# EAGLE schematic proportional configuration #1 (EAGLE 9.6.2)
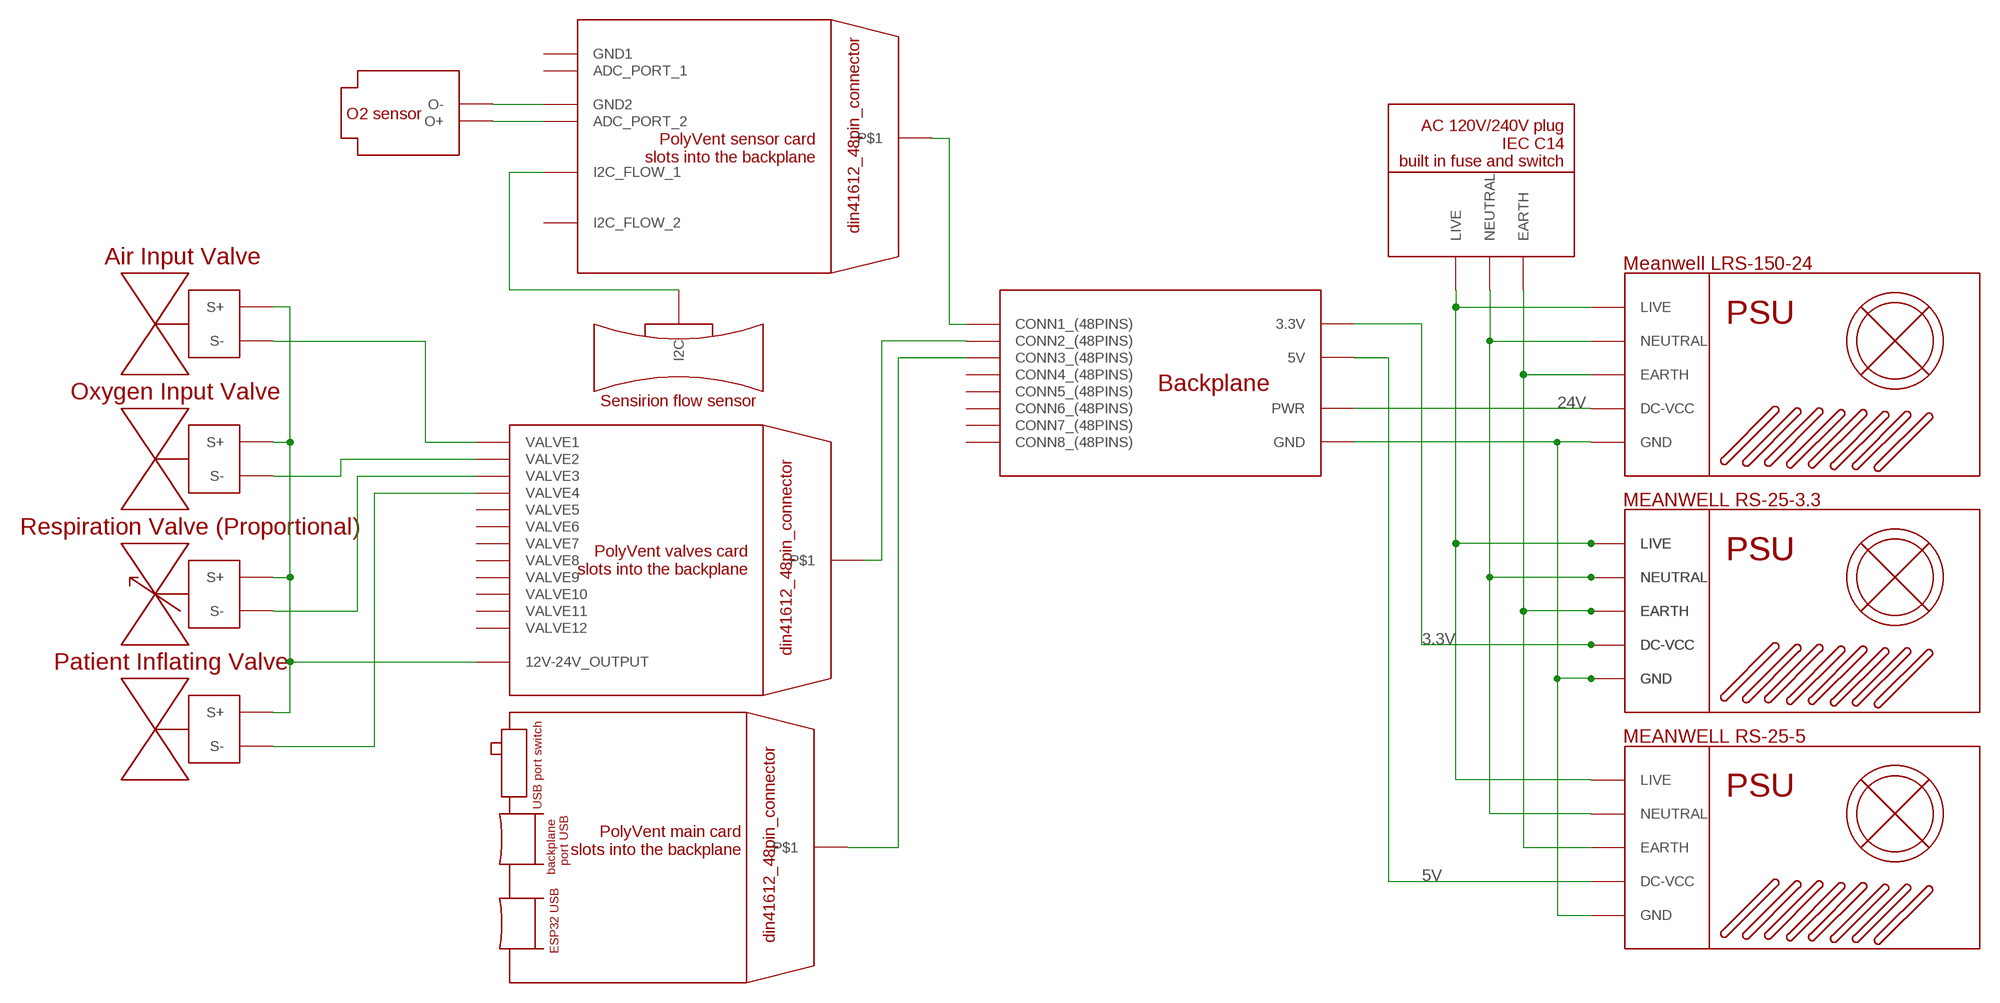
[diagram p0: schematic, sheet 1]

## Parts
U$1  BACKPLANE  (no package)
U$2  POWER_PLUG_WITH_FUSE_AND_SWITCH  (no package)
U$3  MEANWELL LRS-150-24  PSU  (no package)
U$4  MEANWELL RS-25-3.3  PSU  (no package)
U$5  MEANWELL RS-25-5  PSU  (no package)
U$6  MEANWELL RS-25-3.3  PSU  (no package)
U$8  VALVES_CARD  (no package)
U$9  SENSOR_CARD  (no package)
U$10  MAIN_CARD  (no package)
U$11  SOLENOID_VALVE  (no package)
U$12  FLOW_SENSOR  (no package)
U$16  SOLENOID_VALVE  (no package)
U$17  SOLENOID_VALVE  (no package)
U$21  SOLENOID_VALVE  (no package)
U$22  OXYGEN_SENSOR  (no package)

## Nets
3.3V: U$1.3.3V U$4.DC-VCC U$6.DC-VCC
5V: U$1.5V U$5.DC-VCC
24V: U$1.PWR U$3.DC-VCC
N$1: U$2.EARTH U$3.EARTH U$4.EARTH U$5.EARTH U$6.EARTH
N$2: U$2.NEUTRAL U$3.NEUTRAL U$4.NEUTRAL U$5.NEUTRAL U$6.NEUTRAL
N$3: U$2.LIVE U$3.LIVE U$4.LIVE U$5.LIVE U$6.LIVE
N$4: U$1.CONN1_(48PINS) U$9.P$1
N$5: U$1.GND U$3.GND U$4.GND U$5.GND U$6.GND
N$6: U$1.CONN2_(48PINS) U$8.P$1
N$7: U$8.VALVE4 U$21.S-
N$8: U$1.CONN3_(48PINS) U$10.P$1
N$9: U$8.12V-24V_OUTPUT U$11.S+ U$16.S+ U$17.S+ U$21.S+
N$10: U$8.VALVE1 U$11.S-
N$11: U$8.VALVE2 U$16.S-
N$12: U$8.VALVE3 U$17.S-
N$30: U$9.I2C_FLOW_1 U$12.I2C
N$32: U$9.ADC_PORT_2 U$22.O+
N$33: U$9.GND2 U$22.O-
Unconnected: U$1.CONN4_(48PINS) U$1.CONN5_(48PINS) U$1.CONN6_(48PINS) U$1.CONN7_(48PINS) U$1.CONN8_(48PINS) U$8.VALVE5 U$8.VALVE6 U$8.VALVE7 U$8.VALVE8 U$8.VALVE9 U$8.VALVE10 U$8.VALVE11 U$8.VALVE12 U$9.ADC_PORT_1 U$9.GND1 U$9.I2C_FLOW_2

## Notes on the sheet
- Air Input Valve | Meanwell LRS-150-24
- Oxygen Input Valve
- MEANWELL RS-25-3.3
- Respiration Valve (Proportional)
- Patient Inflating Valve
- MEANWELL RS-25-5

## Library data of the parts
U$1 = polyvent card schematics:BACKPLANE
U$2 = polyvent card schematics:POWER_PLUG_WITH_FUSE_AND_SWITCH
U$3-U$6 = polyvent card schematics:PSU
U$8 = polyvent card schematics:VALVES_CARD
U$9 = polyvent card schematics:SENSOR_CARD
U$10 = polyvent card schematics:MAIN_CARD
U$11 U$16 U$17 U$21 = polyvent card schematics:SOLENOID_VALVE
U$12 = polyvent card schematics:FLOW_SENSOR
U$22 = polyvent card schematics:OXYGEN_SENSOR

## Net classes
1 POWER: clearance 0.508 mm